# EAGLE design HRI_2020_sky_pupper_sesnor_pack (EAGLE 9.4.2)
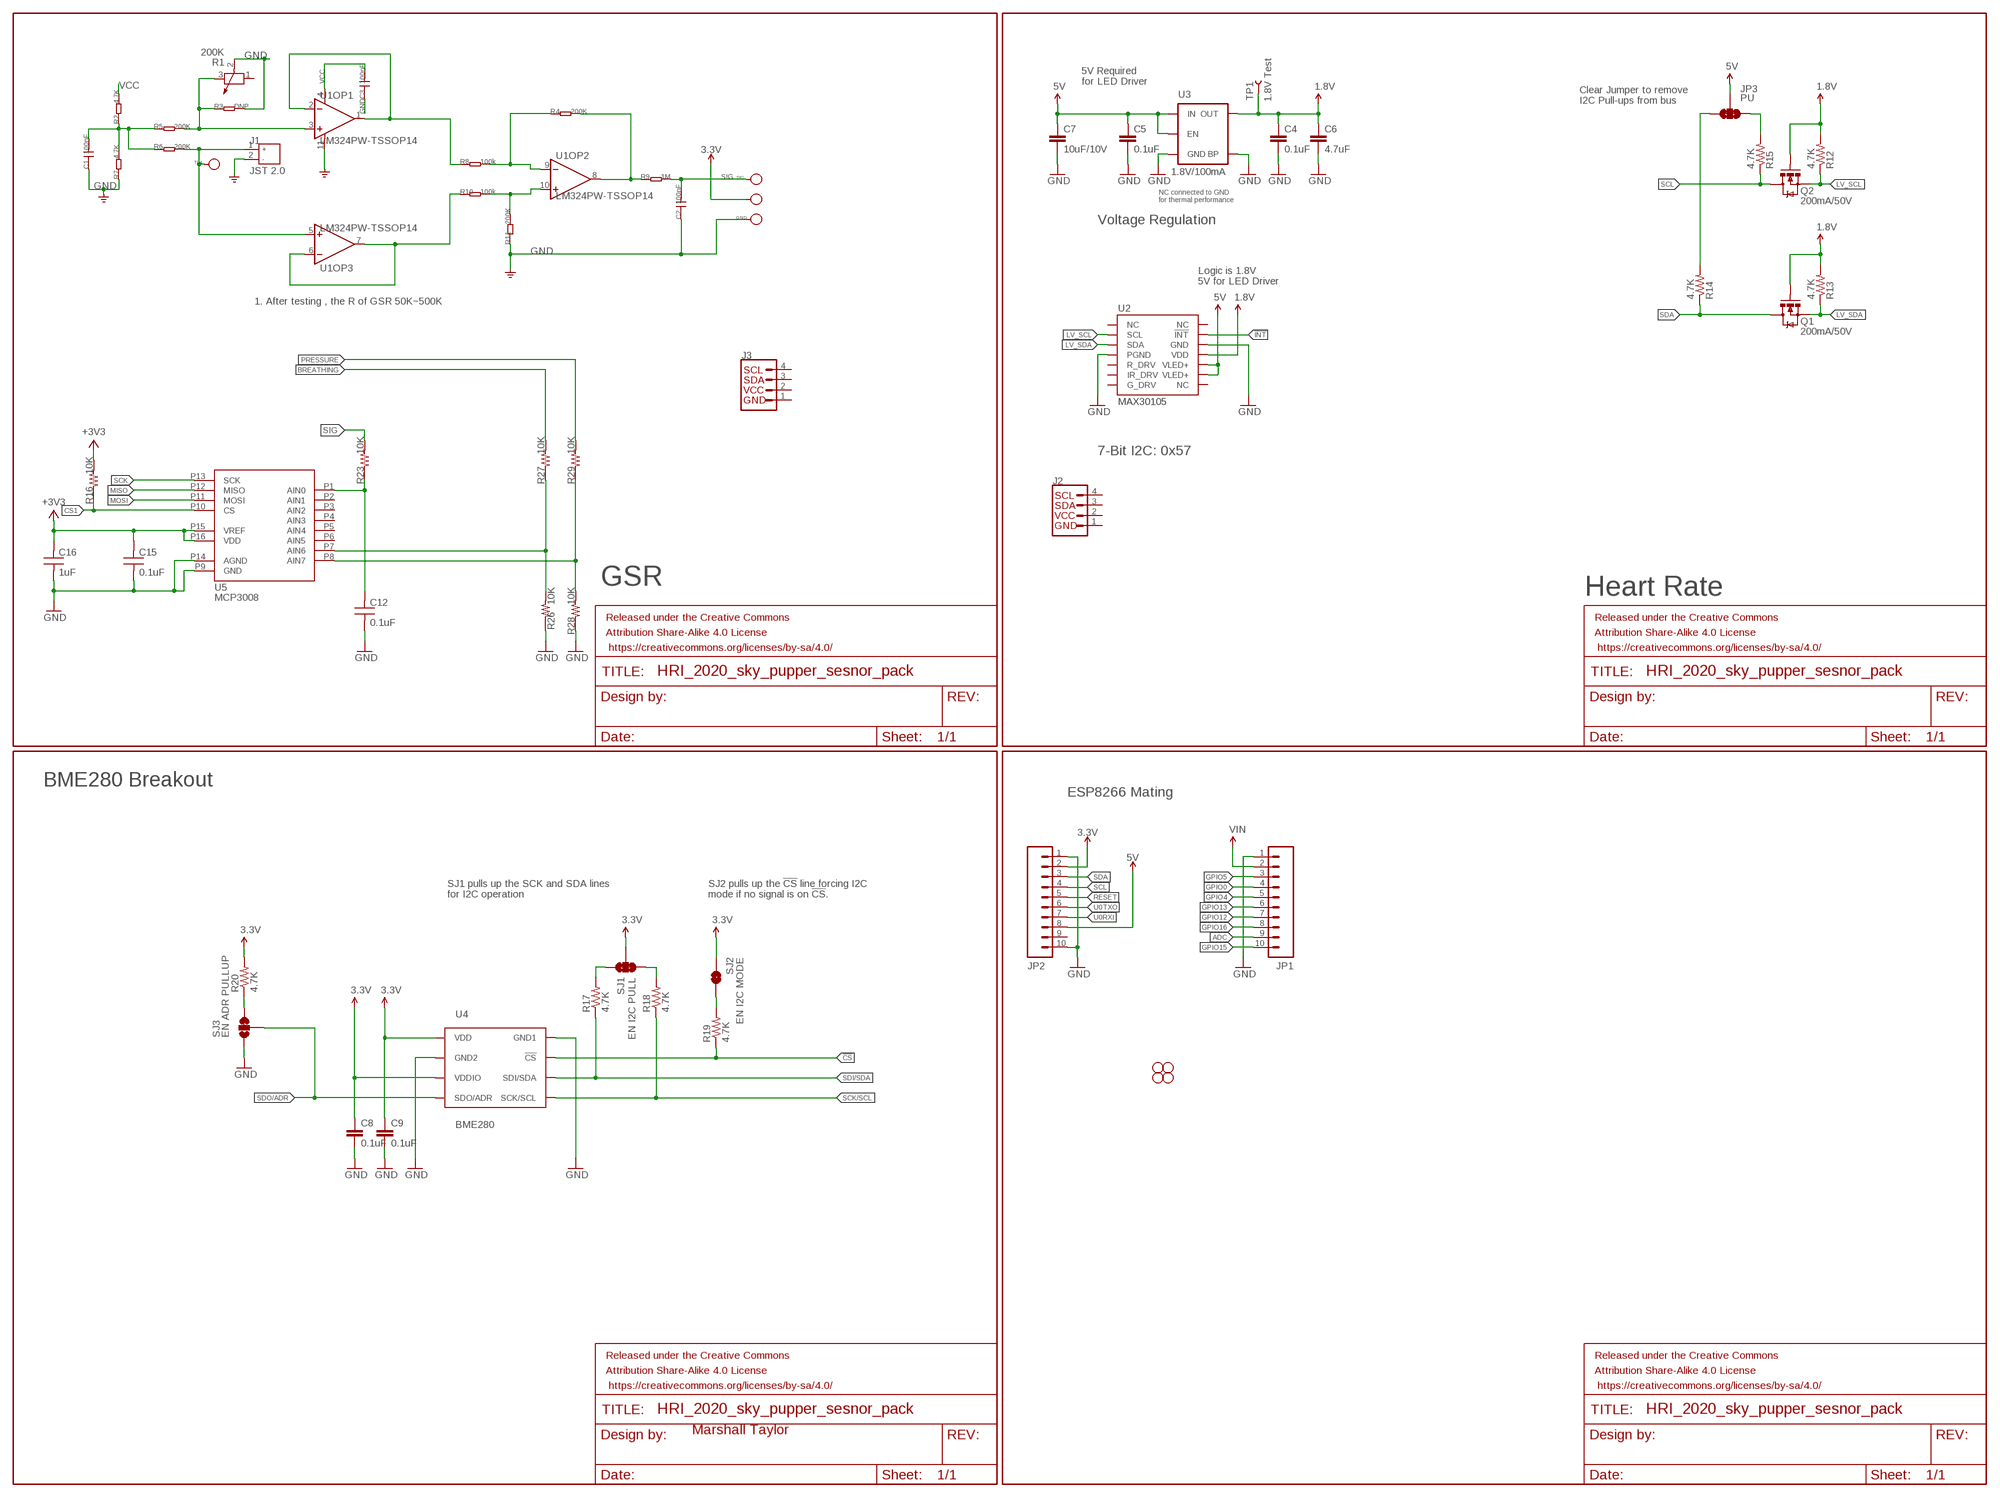
[diagram p0: schematic, sheet 1, part 1 of 2]
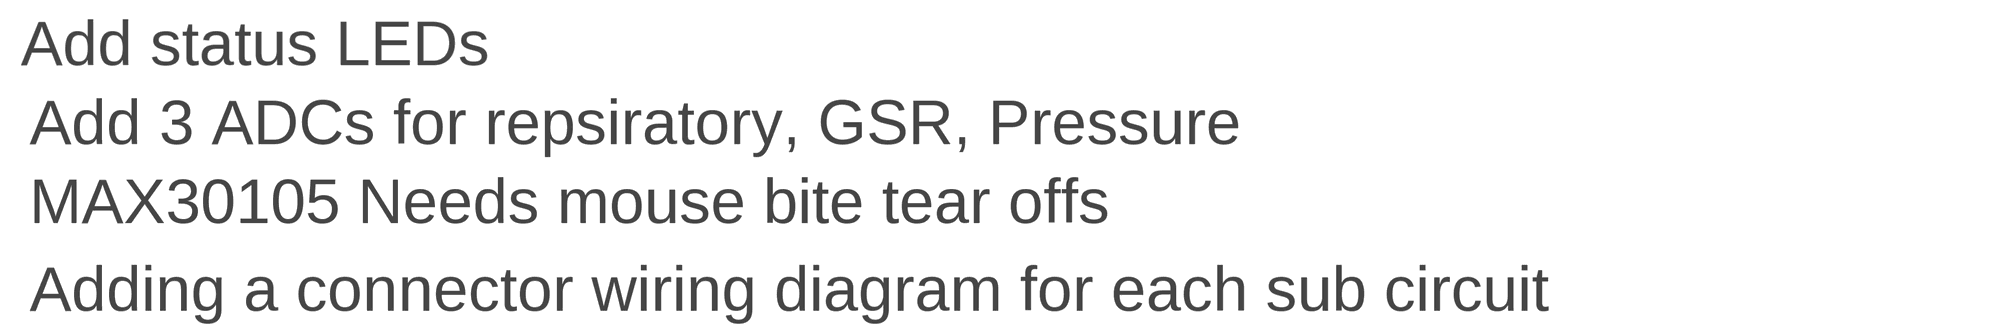
[diagram p1: schematic, sheet 1, part 2 of 2]

## Parts
C1  100nF  C-0603  [0603]
C2  100nF  C-0603  [0603]
C3  100nF  C-0603  [0603]
C4  0.1uF  0.1UF-25V(+80/-20%)(0603)  [0603-CAP@1]
C5  0.1uF  0.1UF-25V(+80/-20%)(0603)  [0603-CAP@1]
C6  4.7uF  4.7UF-6.3V-10%(0603)0603  [0603-CAP@1]
C7  10uF/10V  10UF10V10%(0805)  [0805-CAP]
C8  0.1uF  0.1UF-25V-5%(0603)  [0603-CAP]
C9  0.1uF  0.1UF-25V-5%(0603)  [0603-CAP]
C12  0.1uF  CAPACITORC_0603_SILK  [0603_SILK]
C15  0.1uF  CAPACITORC_0603_SILK  [0603_SILK]
C16  1uF  CAPACITORC_0603_SILK  [0603_SILK]
FRAME1  FRAME-LETTERNO_PACKAGE  [DUMMY]
FRAME2  FRAME-LETTERNO_PACKAGE  [DUMMY]
FRAME3  FRAME-LETTERNO_PACKAGE  [DUMMY]
FRAME4  FRAME-LETTERNO_PACKAGE  [DUMMY]
GND  PAD-TEST-POINT'4545'  [TP_4545]
J1  JST 2.0  JACK-JST-2P-PW'2.0'  [JST-2.0]
J2  QWIIC_CONNECTORJS-1MM  [1X04_1MM_RA]
J3  QWIIC_CONNECTORJS-1MM  [1X04_1MM_RA]
JP1  M10NO_SILK_PTH_FEMALE  [1X10_NO_SILK]
JP2  M10NO_SILK_PTH_FEMALE  [1X10_NO_SILK]
JP3  PU  JUMPER-PAD-3-NC_BY_TRACE  [PAD-JUMPER-3-3OF3_NC_BY_TRACE_YES_SILK_FULL_BOX]
Q1  200mA/50V  MOSFET-NCHANNELBSS138  [SOT23-3]
Q2  200mA/50V  MOSFET-NCHANNELBSS138  [SOT23-3]
R1  200K  R-POTENTIOMETER-SMD  [3P-SMD-RECT-3.3X3.6]
R2  4.7K  R-0603  [0603]
R3  DNP  R-0603  [0603]
R4  200K  R-0603  [0603]
R5  200K  R-0603  [0603]
R6  200K  R-0603  [0603]
R7  4.7K  R-0603  [0603]
R8  100k  R-0603  [0603]
R9  1M  R-0603  [0603]
R10  100k  R-0603  [0603]
R11  200K  R-0603  [0603]
R12  4.7K  4.7KOHM-1/10W-1%(0603)  [0603-RES]
R13  4.7K  4.7KOHM-1/10W-1%(0603)  [0603-RES]
R14  4.7K  4.7KOHM-1/10W-1%(0603)  [0603-RES]
R15  4.7K  4.7KOHM-1/10W-1%(0603)  [0603-RES]
R16  10K  RESISTORR_0603_SILK  [0603_SILK]
R17  4.7K  4.7KOHM-1/10W-1%(0603)  [0603-RES]
R18  4.7K  4.7KOHM-1/10W-1%(0603)  [0603-RES]
R19  4.7K  4.7KOHM-1/10W-1%(0603)  [0603-RES]
R20  4.7K  4.7KOHM-1/10W-1%(0603)  [0603-RES]
R23  10K  RESISTORR_0603_SILK  [0603_SILK]
R26  10K  RESISTORR_0603_SILK  [0603_SILK]
R27  10K  RESISTORR_0603_SILK  [0603_SILK]
R28  10K  RESISTORR_0603_SILK  [0603_SILK]
R29  10K  RESISTORR_0603_SILK  [0603_SILK]
SIG  PAD-TEST-POINT'4545'  [TP_4545]
SJ1  EN I2C PULL  JUMPER-PAD-3-NC_BY_TRACE  [PAD-JUMPER-3-3OF3_NC_BY_TRACE_YES_SILK_FULL_BOX]
SJ2  EN I2C MODE  JUMPER-PAD-2-NC_BY_TRACE  [PAD-JUMPER-2-NC_BY_TRACE_YES_SILK]
SJ3  EN ADR PULLUP  JUMPER-PAD-3-2OF3_NC_BY_TRACE_SMALL  [PAD-JUMPER-3-2OF3_NC_BY_TRACE_YES_SILK_FULL_BOX]
STANDOFF1  STAND-OFF  [STAND-OFF]
STANDOFF2  STAND-OFF  [STAND-OFF]
STANDOFF3  STAND-OFF  [STAND-OFF]
STANDOFF4  STAND-OFF  [STAND-OFF]
TP1  1.8V Test  TEST-POINT3X4  [PAD.03X.04]
TP4  PAD-TEST-POINT'4545'  [TP_4545]
U1  LM324PW-TSSOP14  LMV324-TSSOP14  [TSSOP14]
U2  MAX30105  MAX30105SMD  [OLGA-14]
U3  1.8V/100mA  V_REG_SP62141.8V  [SC70]
U4  BME280  [BME280_LGA]
U5  MCP3008  [SOIC-16]
VCC  PAD-TEST-POINT'4545'  [TP_4545]

## Nets
1.8V: C4.1 C6.1 Q1.1(G) Q2.1(G) R12.2 R13.2 TP1.P$1 U2.11(VDD) U3.5(OUT)
3.3V: C8.1 C9.1 JP2.2 R20.2 SJ1.2 SJ2.2 U4.P$6(VDDIO) U4.P$8(VDD) VCC.T
5V: C5.1 C7.1 JP2.8 JP3.2 U2.9(VLED+) U2.10(VLED+) U3.1(IN) U3.3(EN)
!CS: R19.1 U4.P$2(!CS)
!INT: U2.13(!INT)
+3V3: C15.P1 C16.P1 R16.P2 U5.P15(VREF) U5.P16(VDD)
ADC: JP1.9
BREATHING: R27.P2
CS1: R16.P1 U5.P10(CS)
GND: C1.1 C2.1 C3.1 C4.2 C5.2 C6.2 C7.2 C8.2 C9.2 C12.P2 C15.P2 C16.P2 GND.T J1.2 JP1.1 JP2.1 JP2.10 R1.2 R3.2 R7.1 R11.1 R26.P1 R28.P1 SJ3.1 U1.11(OP1:V-) U2.4(PGND) U2.12(GND) U3.2(GND) U3.4(BP) U4.P$1(GND1) U4.P$7(GND2) U5.P9(GND) U5.P14(AGND)
GPIO0: JP1.4
GPIO4: JP1.5
GPIO5: JP1.3
GPIO12: JP1.7
GPIO13: JP1.6
GPIO15: JP1.10
GPIO16: JP1.8
IN: J1.1 R6.2 TP4.T U1.5(OP3:IN+)
LV_SCL: Q2.2(S) R12.1 U2.2(SCL)
LV_SDA: Q1.2(S) R13.1 U2.3(SDA)
MISO: U5.P12(MISO)
MOSI: U5.P11(MOSI)
N$1: R8.1 U1.1(OP1:OUT) U1.2(OP1:IN-)
N$2: R10.1 U1.6(OP3:IN-) U1.7(OP3:OUT)
N$3: R4.1 R8.2 U1.9(OP2:IN-)
N$4: R4.2 R9.1 U1.8(OP2:OUT)
N$5: R10.2 R11.2 U1.10(OP2:IN+)
N$6: C1.2 R2.1 R5.1 R6.1 R7.2
N$8: R1.3 R3.1 R5.2 U1.3(OP1:IN+)
N$9: JP3.1 R15.2
N$10: JP3.3 R14.2
N$11: R17.2 SJ1.3
N$12: R18.2 SJ1.1
N$13: R19.2 SJ2.1
N$14: R20.1 SJ3.3
N$15: R26.P2 R27.P1 U5.P7(AIN6)
N$16: R28.P2 R29.P1 U5.P8(AIN7)
N$17: C12.P1 R23.P1 U5.P1(AIN0)
PRESSURE: R29.P2
RESET: JP2.5
SCK: U5.P13(SCK)
SCK/SCL: R18.1 U4.P$4(SCK/SCL)
SCL: JP2.4 Q2.3(D) R15.1
SDA: JP2.3 Q1.3(D) R14.1
SDI/SDA: R17.1 U4.P$3(SDI/SDA)
SDO/ADR: SJ3.2 U4.P$5(SDO/ADR)
SIG: C2.2 R9.2 R23.P2 SIG.T
U0RXI: JP2.7
U0TXO: JP2.6
VCC: C3.2 R2.2 U1.4(OP1:V+)
VIN: JP1.2
Unconnected: J2.3(SDA) J2.4(SCL) J3.3(SDA) J3.4(SCL) JP2.9 R1.1 U1.12(OP4:IN+) U1.13(OP4:IN-) U1.14(OP4:OUT) U2.1(NC) U2.5(R_DRV) U2.6(IR_DRV) U2.7(G_DRV) U2.8(NC) U2.14(NC) U5.P2(AIN1) U5.P3(AIN2) U5.P4(AIN3) U5.P5(AIN4) U5.P6(AIN5)

## Notes on the sheet
- Add status LEDs
- Add 3 ADCs for repsiratory, GSR, Pressure
- 5V Required
  for LED Driver
- Clear Jumper to remove 
  I2C Pull-ups from bus
- MAX30105 Needs mouse bite tear offs
- Adding a connector wiring diagram for each sub circuit
- NC connected to GND
  for thermal performance
- Voltage Regulation
- Logic is 1.8V
  5V for LED Driver
- 1. After testing , the R of GSR 50K~500K
- 7-Bit I2C: 0x57
- GSR
- Heart Rate
- BME280 Breakout
- ESP8266 Mating
- SJ1 pulls up the SCK and SDA lines
  for I2C operation
- SJ2 pulls up the !CS! line forcing I2C
  mode if no signal is on !CS!.
- Marshall Taylor

## Power pins joined to a net without a drawn wire
GND: J2.1(GND) J3.1(GND)
VCC: J2.2(VCC) J3.2(VCC)

## Library data of the parts
C1-C3 = Discreter:C*: Ceramic Capacitors
C4 C5 = SparkFun-Capacitors:0.1UF-25V(+80/-20%)(0603): CAP-00810 Ceramic Standard decoupling cap; PROD_ID: CAP-00810
C6 = SparkFun-Capacitors:4.7UF-6.3V-10%(0603): CAP-08280; PROD_ID: CAP-08280
C7 = SparkFun-Capacitors:10UF10V10%(0805): CAP-11330; PROD_ID: CAP-11330
C8 C9 = SparkFun-Capacitors:0.1UF-25V-5%(0603): CAP-08604; PROD_ID: CAP-08604
C12 C15 C16 = 1_BES_Passives:CAPACITOR: SMT Capacitor; PARTNO: GRM188R70J104KA01D
FRAME1-FRAME4 = SparkFun-Aesthetics:FRAME-LETTER: Schematic Frame - Letter Standard 8.5x11 US Letter frame; DESIGNER: Nobody; VERSION: v01
GND SIG TP4 VCC = Discrete:PAD-TEST-POINT; PARTNO: DNP
J1 = Connector:JACK-JST-2P-PW
J2 J3 = SparkFun-Connectors:QWIIC_CONNECTOR: SparkFun I2C Standard Qwiic Connector An SMD 1mm pitch JST connector makes it easy and quick (get it? Qwiic?) to connect I2C devices to each other. The Qwiic system <http://www.sparkfun.com/qwiic> enables fast and solderless connection between popular platforms and various sensors and actuators. We carry 200mm <https://www.sparkfun.com/products/14204>, 100mm <https://www.sparkfun.com/products/14205>, 50mm <https://www.sparkfun.com/products/14206>, and breadboard friendly <https://www.sparkfun.com/products/14207> Qwiic cables. We also offer 10 pcs strips <https://www.sparkfun.com/products/14323> the SMD connectors.
JP1 JP2 = SparkFun-Connectors:M10: Header 10 Standard 10-pin 0.1" header. Use with straight break away headers (SKU : PRT-00116), right angle break away headers (PRT-00553), swiss pins (PRT-00743), machine pins (PRT-00117), and female headers (PRT-00115).; PROD_ID: CONN-11563
JP3 SJ1 = SparkFun-Passives:JUMPER-PAD-3-NC_BY_TRACE
Q1 Q2 = SparkFun-DiscreteSemi:MOSFET-NCHANNEL: Common NMOSFET Parts MFG P/N Store ID Prod ID FDD8780 TRANS-09984 SI7820DN TRANS-11055 FDS6630A IC-08089 2N7002PW TRANS-11151 FQP30N06L COM-10213 TRANS-10060 BSS123LT1G TRANS-08345 BSS138 TRANS-00830 BS170 2N7000; PROD_ID: TRANS-00830
R1 = Discreter:R-POTENTIOMETER*: Potentiometer
R2-R11 = Discreter:R*
R12-R15 R17-R20 = SparkFun-Resistors:4.7KOHM-1/10W-1%(0603): RES-07857; PROD_ID: RES-07857
R16 R23 R26-R29 = 1_BES_Passives:RESISTOR: Resistor, Chip Mount, SMT; PARTNO: CR0603-FX-1002ELF
SJ2 = SparkFun-Passives:JUMPER-PAD-2-NC_BY_TRACE
SJ3 = SparkFun-Passives:JUMPER-PAD-3-2OF3_NC_BY_TRACE
STANDOFF1-STANDOFF4 = SparkFun-Electromechanical:STAND-OFF: #4 Stand Off This is the mechanical footprint for a #4 phillips button head screw. Use the keepout ring to avoid running the screw head into surrounding components. SKU : PRT-00447
TP1 = SparkFun-Passives:TEST-POINT: Bare copper test points for troubleshooting or ICT
U1 = IC:LMV324: General purpose LOW Voltage, Rail-to-Rail Output Amplifiers http://www.fairchildsemi.com/ds/LM/LMV358.pdf
U2 = SparkFun-Sensors:MAX30105: Description: Particle Detection IC. Primarily used for smoke detection, can be used for Pulse Detection, Pulse Ox, and possible visual particle detection.; PROD_ID: IC-13510
U3 = SparkFun-PowerIC:V_REG_SP6214; PROD_ID: VREG-08428
U4 = BME280ComponentLibrary:BME280; PROD_ID: IC-13090
U5 = 1_BES_ANALOGIC:MCP3008: 2.7V-5.5V 8-Channel 10-Bit A/D Converters with SPI Serial Interface

## Net classes
1 power: width 0.203 mm

## Board
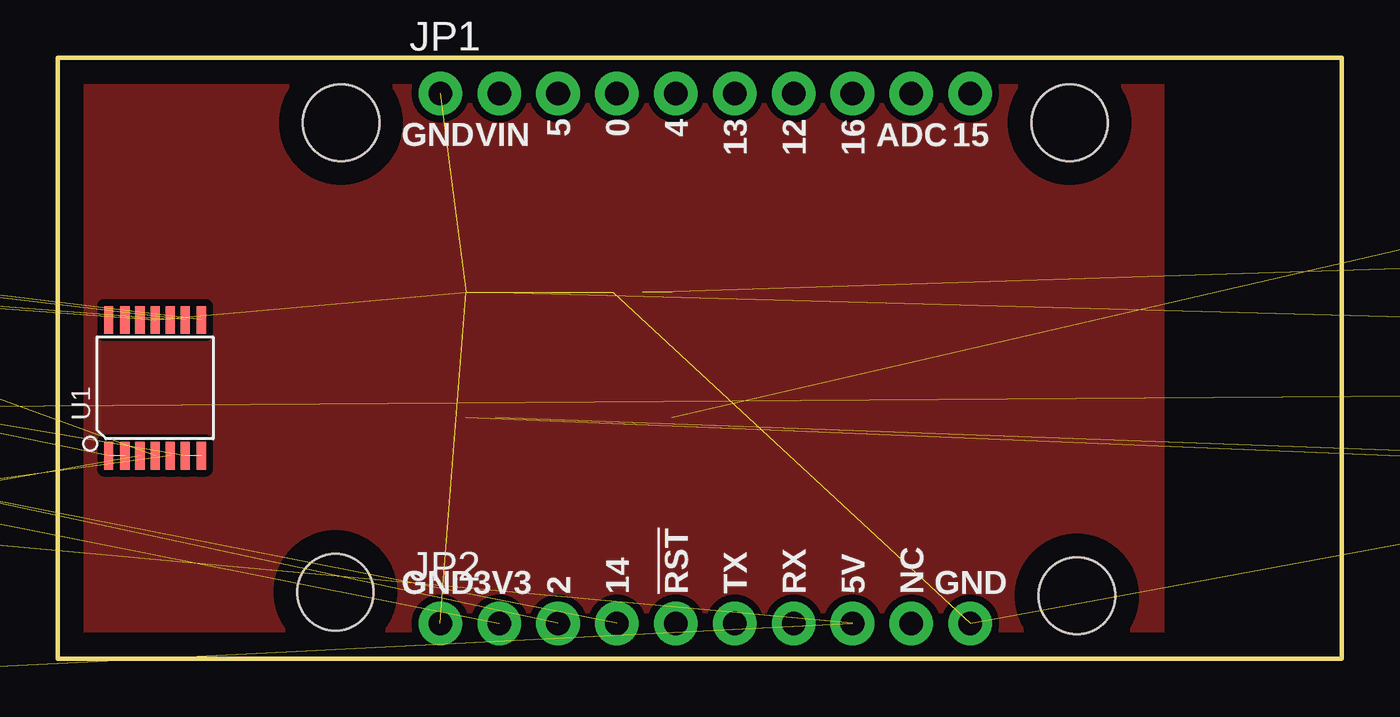
[diagram p2: board, top side]
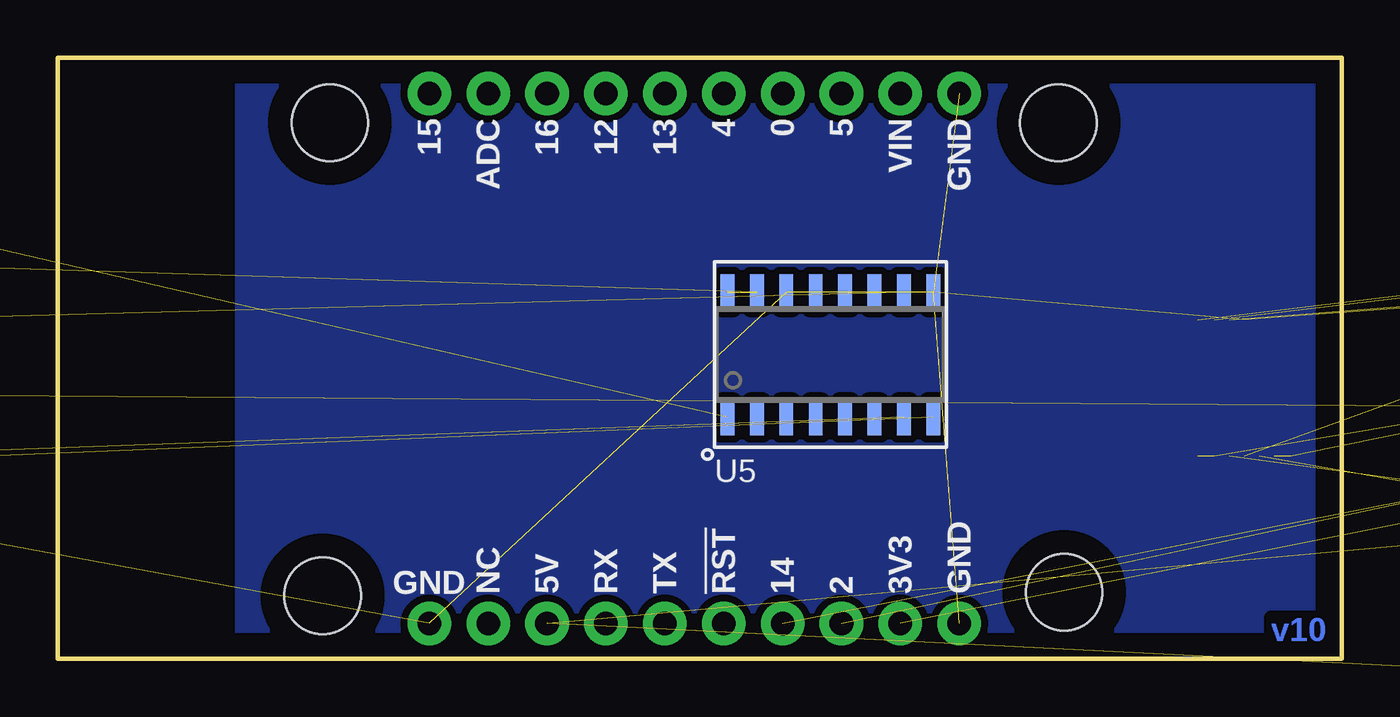
[diagram p3: board, bottom side, seen from below]

Size 55.37 x 25.91 mm. Coordinates in mm from the lower left corner, seen from the top.
Outline: 0,0 0,25.91 55.37,25.91 55.37,0 0,0
Copper layers (1*16): Top 0.035mm / dielectric 1.5mm / Bottom 0.035mm
Design rules "default": minimum track width 6mil, minimum drill 0.35mm, track to track 6mil, track to pad 6mil, pad to pad 6mil, via to via 6mil, smd to smd 6mil, copper to edge 40mil, drill to drill 6mil, minimum pad ring 10mil, minimum via ring 8mil, stop-mask expansion 4mil, vias tented up to drill 0mil, thermal gap 10mil

### Footprints (pad centres in the part's own frame; a part is rotated, then mirrored left to right if it is on the bottom)
0603 = smd 0.889 x 0.889: 1 -0.762,0; 2 0.762,0
0603-CAP@1 = smd 1.1 x 1: 1 -0.85,0; 2 0.85,0
0805-CAP = smd 0.8 x 1.2: 1 -0.9,0; 2 0.9,0
0603-CAP = smd 1.1 x 1: 1 -0.85,0; 2 0.85,0
0603_SILK = smd 0.8 x 1: P1 -0.7,0; P2 0.7,0
TP_4545 = smd 1.143 x 1.143: T 0,0
JST-2.0 = drill 0.8 pad 1.3 square: 1 -1,0.75 | drill 0.8 pad 1.3: 2 1,0.75
1X04_1MM_RA = smd 0.6 x 1.35: 1 -1.5,0; 2 -0.5,0; 3 0.5,0; 4 1.5,0 | smd 1.2 x 2: NC1 2.8,-3.675; NC2 -2.8,-3.675
1X10_NO_SILK = drill 1.016 pad 1.88: 1 0,0; 2 2.54,0; 3 5.08,0; 4 7.62,0; 5 10.16,0; 6 12.7,0; 7 15.24,0; 8 17.78,0; 9 20.32,0; 10 22.86,0
PAD-JUMPER-3-3OF3_NC_BY_TRACE_YES_SILK_FULL_BOX = smd 0.635 x 1.27: 1 -0.813,0; 2 0,0; 3 0.813,0
SOT23-3 = smd 0.8 x 0.9: 1 -0.95,-1; 2 0.95,-1; 3 0,1.1
3P-SMD-RECT-3.3X3.6 = smd 1 x 0.9: 1 -0.85,-1.45; 3 0.85,-1.45 | smd 1.1 x 0.9: 2 0,1.45
0603-RES = smd 1.1 x 1: 1 -0.85,0; 2 0.85,0
PAD-JUMPER-2-NC_BY_TRACE_YES_SILK = smd 0.635 x 1.27: 1 -0.508,0; 2 0.508,0
PAD-JUMPER-3-2OF3_NC_BY_TRACE_YES_SILK_FULL_BOX = smd 0.635 x 1.27: 1 -0.813,0; 2 0,0; 3 0.813,0
STAND-OFF = hole 3.302: 0,0
PAD.03X.04 = smd 1.016 x 1.016: P$1 0,0
TSSOP14 = smd 0.4 x 1.2: 1 -2,-2.925; 2 -1.3,-2.925; 3 -0.65,-2.925; 4 0,-2.925; 5 0.65,-2.925; 6 1.3,-2.925; 7 2,-2.925; 8 2,2.925; 9 1.3,2.925; 10 0.65,2.925; 11 0,2.925; 12 -0.65,2.925; 13 -1.3,2.925; 14 -2,2.925
OLGA-14 = smd 0.75 x 0.35: 1 -1.2,2.4; 2 -1.2,1.6; 3 -1.2,0.8; 4 -1.2,0; 5 -1.2,-0.8; 6 -1.2,-1.6; 7 -1.2,-2.4; 8 1.2,-2.4; 9 1.2,-1.6; 10 1.2,-0.8; 11 1.2,0; 12 1.2,0.8; 13 1.2,1.6; 14 1.2,2.4
SC70 = smd 0.4 x 0.75: 1 -0.65,-0.825; 2 0,-0.825; 3 0.65,-0.825; 4 0.65,0.825; 5 -0.65,0.825
BME280_LGA = smd 0.5 x 0.35: P$1 1.025,0.975; P$2 1.025,0.325; P$3 1.025,-0.325; P$4 1.025,-0.975; P$5 -1.025,-0.975; P$6 -1.025,-0.325; P$7 -1.025,0.325; P$8 -1.025,0.975
SOIC-16 = smd 0.6 x 1.55: P1 -4.445,-2.7; P2 -3.175,-2.7; P3 -1.905,-2.7; P4 -0.635,-2.7; P5 0.635,-2.7; P6 1.905,-2.7; P7 3.175,-2.7; P8 4.445,-2.7; P9 4.445,2.7; P10 3.175,2.7; P11 1.905,2.7; P12 0.635,2.7; P13 -0.635,2.7; P14 -1.905,2.7; P15 -3.175,2.7; P16 -4.445,2.7

### Placement (x,y rotation side)
C1  -71.37,15.49 0 top  (outside the outline)
C2  -75.18,15.49 0 top  (outside the outline)
C3  -78.99,15.49 0 top  (outside the outline)
C4  -76.45,11.68 0 top  (outside the outline)
C5  -25.65,16.76 0 top  (outside the outline)
C6  -29.46,16.76 0 top  (outside the outline)
C7  -57.4,11.68 0 top  (outside the outline)
C8  -33.27,16.76 0 top  (outside the outline)
C9  -37.08,16.76 0 top  (outside the outline)
C12  67.45,20.02 0 bottom  (outside the outline)
C15  67.45,17.16 0 bottom  (outside the outline)
C16  62.85,5.73 0 bottom  (outside the outline)
FRAME1  -63.75,19.3 0 top  (outside the outline)
FRAME2  -66.29,19.3 0 top  (outside the outline)
FRAME3  -68.83,19.3 0 top  (outside the outline)
FRAME4  -71.37,19.3 0 top  (outside the outline)
GND  -61.21,10.41 0 top  (outside the outline)
J1  -70.1,-2.29 0 top  (outside the outline)
J2  -77.25,-50.07 0 top  (outside the outline)
J3  -77.25,-55.63 0 top  (outside the outline)
JP1  16.49,24.38 0 top
JP2  16.49,1.52 0 top
JP3  -35.81,11.68 0 top  (outside the outline)
Q1  -44.7,11.68 0 top  (outside the outline)
Q2  -48.51,11.68 0 top  (outside the outline)
R1  -75.18,-3.56 0 top  (outside the outline)
R2  -25.65,19.3 0 top  (outside the outline)
R3  -29.46,19.3 0 top  (outside the outline)
R4  -33.27,19.3 0 top  (outside the outline)
R5  -37.08,19.3 0 top  (outside the outline)
R6  -40.89,19.3 0 top  (outside the outline)
R7  -44.7,19.3 0 top  (outside the outline)
R8  -48.51,19.3 0 top  (outside the outline)
R9  -52.32,19.3 0 top  (outside the outline)
R10  -56.13,19.3 0 top  (outside the outline)
R11  -59.94,19.3 0 top  (outside the outline)
R12  -40.89,16.76 0 top  (outside the outline)
R13  -44.7,16.76 0 top  (outside the outline)
R14  -48.51,16.76 0 top  (outside the outline)
R15  -52.32,16.76 0 top  (outside the outline)
R16  74.28,14.3 0 bottom  (outside the outline)
R17  -56.13,16.76 0 top  (outside the outline)
R18  -59.94,16.76 0 top  (outside the outline)
R19  -63.75,16.76 0 top  (outside the outline)
R20  -67.56,16.76 0 top  (outside the outline)
R23  74.28,11.45 0 bottom  (outside the outline)
R26  74.28,8.59 0 bottom  (outside the outline)
R27  68.56,8.59 0 bottom  (outside the outline)
R28  62.85,8.59 0 bottom  (outside the outline)
R29  74.28,5.73 0 bottom  (outside the outline)
SIG  -68.83,10.41 0 top  (outside the outline)
SJ1  -32,11.68 0 top  (outside the outline)
SJ2  -40.89,11.68 0 top  (outside the outline)
SJ3  -26.92,11.68 0 top  (outside the outline)
STANDOFF1  12.21,23.11 0 top
STANDOFF2  43.64,23.11 0 top
STANDOFF3  43.96,2.71 0 top
STANDOFF4  11.97,2.87 0 top
TP1  -73.91,19.3 0 top  (outside the outline)
TP4  -72.64,10.41 0 top  (outside the outline)
U1  4.19,11.68 0 top
U2  -58.67,-2.29 0 top  (outside the outline)
U3  -53.59,10.41 0 top  (outside the outline)
U4  -63.75,-2.29 0 top  (outside the outline)
U5  22.05,13.11 0 bottom
VCC  -65.02,10.41 0 top  (outside the outline)

### Tracks (layer width: path | path; a pad name or v marks a point on that pad's centre or on a via)
1.8V  (8 unrouted)
3.3V  (8 unrouted)
5V  (7 unrouted)
!CS  (1 unrouted)
+3V3  (4 unrouted)
CS1  (1 unrouted)
GND  (34 unrouted)
GND1
  pour Bottom (isolate 0.305, rank 6): 0,0 0,25.91 47.62,25.91 47.62,0
  pour Top (isolate 0.305, rank 6): 0,25.91 0,0 47.62,0 47.62,25.91
IN  (3 unrouted)
LV_SCL  (2 unrouted)
LV_SDA  (2 unrouted)
N$1  (2 unrouted)
N$2  (2 unrouted)
N$3  (2 unrouted)
N$4  (2 unrouted)
N$5  (2 unrouted)
N$6  (4 unrouted)
N$8  (3 unrouted)
N$9  (1 unrouted)
N$10  (1 unrouted)
N$11  (1 unrouted)
N$12  (1 unrouted)
N$13  (1 unrouted)
N$14  (1 unrouted)
N$15  (2 unrouted)
N$16  (2 unrouted)
N$17  (2 unrouted)
SCK/SCL  (1 unrouted)
SCL  (2 unrouted)
SDA  (2 unrouted)
SDI/SDA  (1 unrouted)
SDO/ADR  (1 unrouted)
SIG  (3 unrouted)
VCC  (4 unrouted)

### Text on the board
Bottom: v10
tPlace: 5 | 0 | 4 | 13 | 12 | 16 | GND | VIN | ADC | 15 | GND | 3V3 | 2 | 14 | !RST! | TX | RX | 5V | NC | GND
bPlace: GND | VIN | 5 | 0 | 4 | 13 | 12 | 16 | ADC | 15 | GND | 3V3 | 2 | 14 | !RST! | TX | RX | 5V | NC | GND